# EAGLE design baterry (EAGLE 9.6.0)
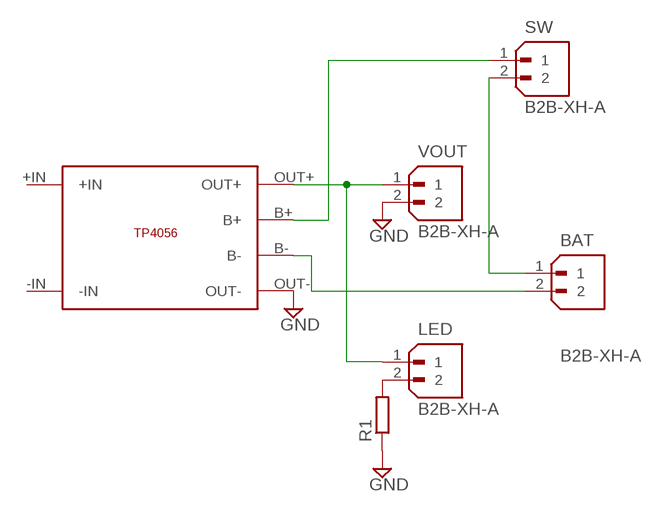
[diagram p0: schematic, sheet 1]

## Parts
BAT  B2B-XH-A  [JST_B2B-XH-A]
LED  B2B-XH-A  [JST_B2B-XH-A]
R1  R-EU_0207/10  [0207/10]
SW  B2B-XH-A  [JST_B2B-XH-A]
U$1  TP4056  [TP4056]
VOUT  B2B-XH-A  [JST_B2B-XH-A]

## Nets
GND: R1.1 U$1.OUT- VOUT.2
N$1: LED.2 R1.2
N$2: BAT.1 SW.2
N$3: LED.1 U$1.OUT+ VOUT.1
N$4: SW.1 U$1.B+
N$5: BAT.2 U$1.B-
Unconnected: U$1.+IN U$1.-IN

## Library data of the parts
BAT LED SW VOUT = B2B-XH-A:B2B-XH-A: Check availability <https://pricing.snapeda.com/parts/B2B-XH-A/JST%20Sales/view-part?ref=eda>; AVAILABILITY: In Stock; CHECK_PRICES: https://www.snapeda.com/parts/B2B-XH-A/JST+Sales+America+Inc./view-part/?ref=eda; DESCRIPTION: Connector Header Through Hole 2 position 0.098 (2.50mm); MF: JST Sales; MP: B2B-XH-A; PACKAGE: None; PRICE: None; PURCHASE-URL: https://www.snapeda.com/api/url_track_click_mouser/?unipart_id=552747&manufacturer=JST Sales&part_name=B2B-XH-A&search_term=jwt xh; SNAPEDA_LINK: https://www.snapeda.com/parts/B2B-XH-A/JST+Sales+America+Inc./view-part/?ref=snap
R1 = rcl:R-EU_: RESISTOR, European symbol; SPICEPREFIX: R
U$1 = TP4056:TP4056

## Board
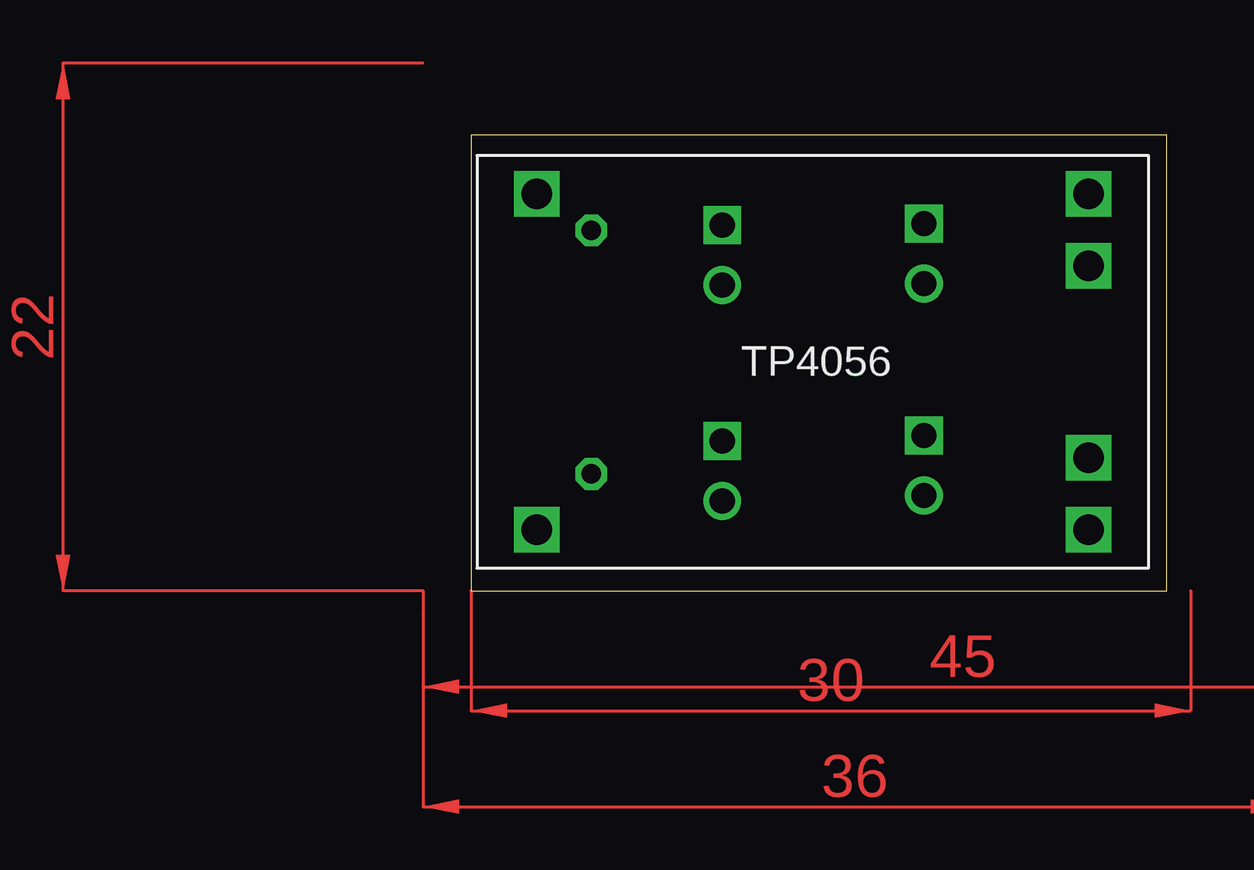
[diagram p1: board, top side]
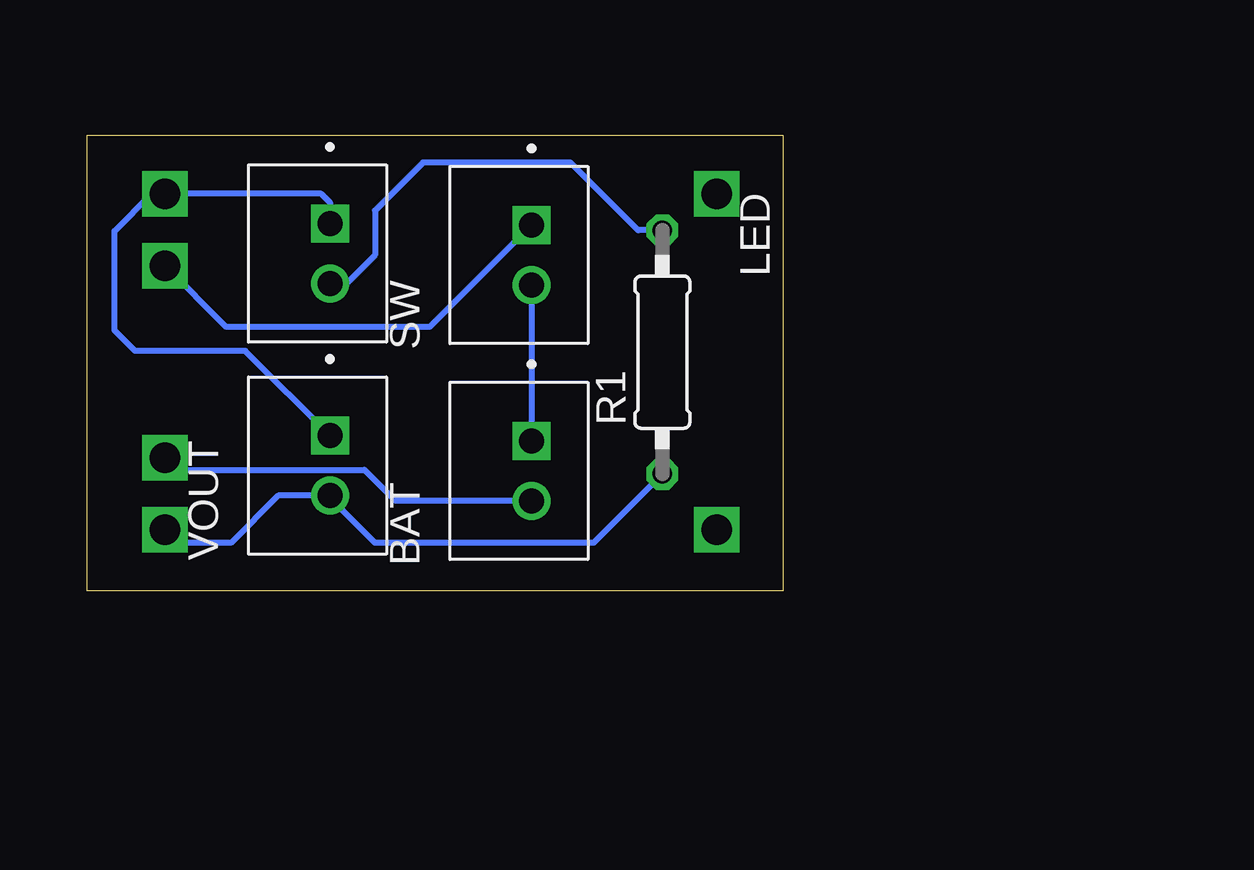
[diagram p2: board, bottom side, seen from below]

Size 29 x 19 mm. Coordinates in mm from the lower left corner, seen from the top.
Outline: 0,0 29,0 29,19 0,19 0,0
Copper layers (1*16): Top 0.035mm / dielectric 1.5mm / Bottom 0.035mm
Design rules "default *": minimum track width 10mil, minimum drill 0.35mm, track to track 10mil, track to pad 10mil, pad to pad 10mil, via to via 10mil, smd to smd 10mil, copper to edge 40mil, drill to drill 10mil, minimum pad ring 10mil, minimum via ring 8mil, stop-mask expansion 4mil, vias tented up to drill 0mil, thermal gap 10mil

### Footprints (pad centres in the part's own frame; a part is rotated, then mirrored left to right if it is on the bottom)
JST_B2B-XH-A = drill 1.05 square: 1 1.25,-0.525 | drill 1.05: 2 -1.25,-0.525
0207/10 = drill 0.813 octagon: 1 -5.08,0; 2 5.08,0
TP4056 = drill 1.27 square: +IN 2.5,15.6; -IN 2.5,1.6; B+ 25.5,12.6; B- 25.5,4.6; OUT+ 25.5,15.6; OUT- 25.5,1.6

### Placement (x,y rotation side)
BAT  11,5 90 bottom
LED  19.4,14.06 90 bottom
R1  5.02,9.95 90 bottom
SW  11,14 90 bottom
U$1  0.25,0.95 0 top
VOUT  19.4,5.22 90 bottom

### Tracks (layer width: path | path; a pad name or v marks a point on that pad's centre or on a via)
GND
  Bottom 0.254: R1.1 7.89,2 17,2 18.88,3.88 VOUT.2 21.03,3.97 23,2 25.2,2 U$1.OUT-
N$1
  Bottom 0.254: R1.2 6.03,15.03 8.86,17.86 15,17.86 17,15.86 17,14 18.19,12.81 LED.2
N$2
  Bottom 0.254: SW.2 BAT.1
N$3
  Bottom 0.254: LED.1 18.88,16.18 19.24,16.55 U$1.OUT+ 26.31,16.55 27.86,15 27.86,10.86 27,10 22.41,10 VOUT.1
N$4
  Bottom 0.254: U$1.B+ 23.2,11 14.73,11 SW.1
N$5
  Bottom 0.254: BAT.2 16.15,3.75 17.43,5.04 25.24,5.04 U$1.B-
(copper drawn outside any net)
  shapes: Top area x4